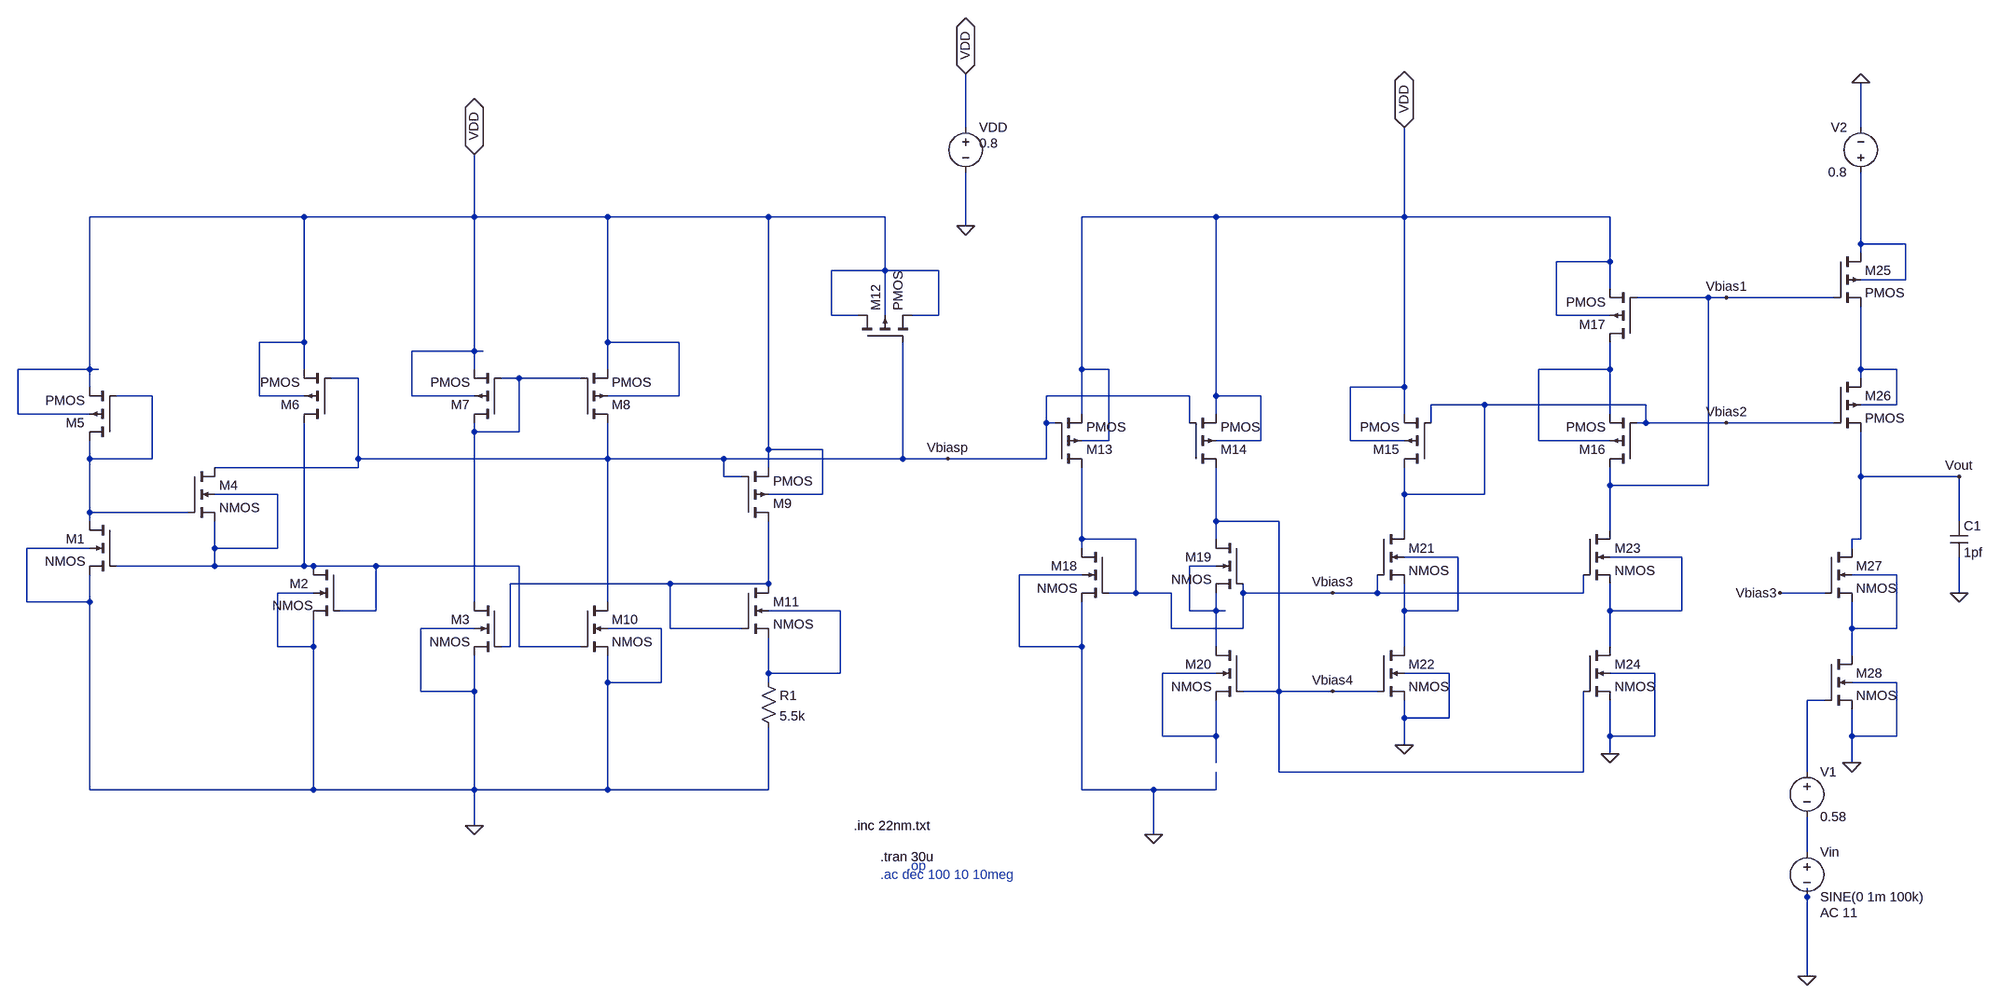
[diagram p0: schematic 22nm.asc]
22nm.asc, the LTspice schematic file:
Version 4
SHEET 1 3552 1044
WIRE 1664 -560 1664 -656
WIRE 3264 -560 3264 -640
WIRE 432 -400 48 -400
WIRE 736 -400 736 -512
WIRE 736 -400 432 -400
WIRE 1024 -400 736 -400
WIRE 1312 -400 1024 -400
WIRE 1520 -400 1312 -400
WIRE 2112 -400 1872 -400
WIRE 2448 -400 2448 -560
WIRE 2448 -400 2112 -400
WIRE 2816 -400 2448 -400
WIRE 1664 -384 1664 -480
WIRE 3264 -352 3264 -480
WIRE 3344 -352 3264 -352
WIRE 3264 -336 3264 -352
WIRE 2816 -320 2816 -400
WIRE 2816 -320 2720 -320
WIRE 1520 -304 1520 -400
WIRE 1520 -304 1424 -304
WIRE 1616 -304 1520 -304
WIRE 3344 -288 3344 -352
WIRE 3344 -288 3264 -288
WIRE 2816 -272 2816 -320
WIRE 2992 -256 2864 -256
WIRE 3024 -256 2992 -256
WIRE 3216 -256 3024 -256
WIRE 1424 -224 1424 -304
WIRE 1472 -224 1424 -224
WIRE 1520 -224 1520 -304
WIRE 1616 -224 1616 -304
WIRE 1616 -224 1568 -224
WIRE 2720 -224 2720 -320
WIRE 2816 -224 2720 -224
WIRE 432 -176 432 -400
WIRE 432 -176 352 -176
WIRE 1024 -176 1024 -400
WIRE 1152 -176 1024 -176
WIRE 736 -160 736 -400
WIRE 736 -160 624 -160
WIRE 752 -160 736 -160
WIRE 48 -128 48 -400
WIRE 48 -128 -80 -128
WIRE 64 -128 48 -128
WIRE 432 -128 432 -176
WIRE 736 -128 736 -160
WIRE 1024 -128 1024 -176
WIRE 1872 -128 1872 -400
WIRE 1920 -128 1872 -128
WIRE 2816 -128 2816 -176
WIRE 2816 -128 2688 -128
WIRE 3264 -128 3264 -240
WIRE 3328 -128 3264 -128
WIRE 528 -112 480 -112
WIRE 816 -112 784 -112
WIRE 976 -112 816 -112
WIRE 3264 -112 3264 -128
WIRE 48 -96 48 -128
WIRE 2448 -96 2448 -400
WIRE 2448 -96 2352 -96
WIRE 160 -80 96 -80
WIRE 352 -80 352 -176
WIRE 432 -80 352 -80
WIRE 624 -80 624 -160
WIRE 736 -80 624 -80
WIRE 1152 -80 1152 -176
WIRE 1152 -80 1024 -80
WIRE 2064 -80 1808 -80
WIRE 2112 -80 2112 -400
WIRE 2192 -80 2112 -80
WIRE 2592 -64 2496 -64
WIRE 2880 -64 2592 -64
WIRE 3328 -64 3328 -128
WIRE 3328 -64 3264 -64
WIRE -80 -48 -80 -128
WIRE 48 -48 -80 -48
WIRE 1872 -48 1872 -128
WIRE 2112 -48 2112 -80
WIRE 2448 -48 2448 -96
WIRE 2816 -48 2816 -128
WIRE 1808 -32 1808 -80
WIRE 1824 -32 1808 -32
WIRE 2064 -32 2064 -80
WIRE 2496 -32 2496 -64
WIRE 2880 -32 2880 -64
WIRE 2880 -32 2864 -32
WIRE 3024 -32 2880 -32
WIRE 3216 -32 3024 -32
WIRE 736 -16 736 -32
WIRE 816 -16 816 -112
WIRE 816 -16 736 -16
WIRE 1920 0 1920 -128
WIRE 1920 0 1872 0
WIRE 2192 0 2192 -80
WIRE 2192 0 2112 0
WIRE 2352 0 2352 -96
WIRE 2448 0 2352 0
WIRE 2688 0 2688 -128
WIRE 2816 0 2688 0
WIRE 1312 16 1312 -400
WIRE 1408 16 1312 16
WIRE 48 32 48 0
WIRE 160 32 160 -80
WIRE 160 32 48 32
WIRE 528 32 528 -112
WIRE 1024 32 1024 -32
WIRE 1024 32 528 32
WIRE 1232 32 1024 32
WIRE 1552 32 1552 -176
WIRE 1552 32 1232 32
WIRE 1632 32 1552 32
WIRE 1808 32 1808 -32
WIRE 1808 32 1632 32
WIRE 528 48 528 32
WIRE 528 48 272 48
WIRE 1312 48 1312 16
WIRE 1232 64 1232 32
WIRE 1264 64 1232 64
WIRE 3264 64 3264 -16
WIRE 3440 64 3264 64
WIRE 2816 80 2816 48
WIRE 2992 80 2992 -256
WIRE 2992 80 2816 80
WIRE 384 96 272 96
WIRE 1408 96 1408 16
WIRE 1408 96 1312 96
WIRE 2448 96 2448 48
WIRE 2592 96 2592 -64
WIRE 2592 96 2448 96
WIRE 48 128 48 32
WIRE 224 128 48 128
WIRE 48 144 48 128
WIRE 2112 144 2112 48
WIRE 2224 144 2112 144
WIRE 3440 144 3440 64
WIRE 2448 160 2448 96
WIRE 2816 160 2816 80
WIRE 1872 176 1872 48
WIRE 1968 176 1872 176
WIRE 2112 176 2112 144
WIRE 3264 176 3264 64
WIRE 3264 176 3248 176
WIRE 48 192 -64 192
WIRE 272 192 272 144
WIRE 384 192 384 96
WIRE 384 192 272 192
WIRE 1872 192 1872 176
WIRE 3248 192 3248 176
WIRE 2544 208 2448 208
WIRE 2944 208 2816 208
WIRE 272 224 272 192
WIRE 272 224 96 224
WIRE 432 224 432 -32
WIRE 432 224 272 224
WIRE 448 224 432 224
WIRE 560 224 448 224
WIRE 816 224 560 224
WIRE 2112 224 2064 224
WIRE 1872 240 1760 240
WIRE 3328 240 3248 240
WIRE 1136 256 800 256
WIRE 1312 256 1312 144
WIRE 1312 256 1136 256
WIRE 448 272 384 272
WIRE 1312 272 1312 256
WIRE 1968 272 1968 176
WIRE 1968 272 1920 272
WIRE 2032 272 1968 272
WIRE 2160 272 2160 256
WIRE 2320 272 2160 272
WIRE 2400 272 2400 240
WIRE 2400 272 2320 272
WIRE 2768 272 2768 240
WIRE 2768 272 2400 272
WIRE 3200 272 3120 272
WIRE 3440 272 3440 208
WIRE -64 288 -64 192
WIRE 48 288 48 240
WIRE 48 288 -64 288
WIRE 736 288 736 -16
WIRE 1024 288 1024 32
WIRE 560 304 560 224
WIRE 560 304 496 304
WIRE 1440 304 1312 304
WIRE 2064 304 2064 224
WIRE 2112 304 2112 272
WIRE 2112 304 2064 304
WIRE 2128 304 2112 304
WIRE 2448 304 2448 256
WIRE 2544 304 2544 208
WIRE 2544 304 2448 304
WIRE 2816 304 2816 256
WIRE 2944 304 2944 208
WIRE 2944 304 2816 304
WIRE 736 336 640 336
WIRE 1120 336 1024 336
WIRE 1136 336 1136 256
WIRE 1264 336 1136 336
WIRE 2032 336 2032 272
WIRE 2160 336 2160 272
WIRE 2160 336 2032 336
WIRE 3248 336 3248 288
WIRE 3328 336 3328 240
WIRE 3328 336 3248 336
WIRE 384 368 384 272
WIRE 448 368 448 320
WIRE 448 368 384 368
WIRE 800 368 800 256
WIRE 800 368 784 368
WIRE 816 368 816 224
WIRE 976 368 816 368
WIRE 1760 368 1760 240
WIRE 1872 368 1872 288
WIRE 1872 368 1760 368
WIRE 2112 368 2112 304
WIRE 2448 368 2448 304
WIRE 2816 368 2816 304
WIRE 3248 384 3248 336
WIRE 1312 416 1312 352
WIRE 1440 416 1440 304
WIRE 1440 416 1312 416
WIRE 2112 416 2016 416
WIRE 2528 416 2448 416
WIRE 2896 416 2816 416
WIRE 1024 432 1024 384
WIRE 1120 432 1120 336
WIRE 1120 432 1024 432
WIRE 1312 432 1312 416
WIRE 3328 432 3248 432
WIRE 640 448 640 336
WIRE 736 448 736 384
WIRE 736 448 640 448
WIRE 2224 448 2224 144
WIRE 2224 448 2160 448
WIRE 2320 448 2224 448
WIRE 2400 448 2320 448
WIRE 3200 464 3168 464
WIRE 2448 496 2448 464
WIRE 2528 496 2528 416
WIRE 2528 496 2448 496
WIRE 2016 528 2016 416
WIRE 2112 528 2112 464
WIRE 2112 528 2016 528
WIRE 2816 528 2816 464
WIRE 2896 528 2896 416
WIRE 2896 528 2816 528
WIRE 3248 528 3248 480
WIRE 3328 528 3328 432
WIRE 3328 528 3248 528
WIRE 2448 544 2448 496
WIRE 2816 560 2816 528
WIRE 2112 576 2112 528
WIRE 3248 576 3248 528
WIRE 2224 592 2224 448
WIRE 2768 592 2768 448
WIRE 2768 592 2224 592
WIRE 3168 592 3168 464
WIRE 48 624 48 288
WIRE 448 624 448 368
WIRE 448 624 48 624
WIRE 736 624 736 448
WIRE 736 624 448 624
WIRE 1024 624 1024 432
WIRE 1024 624 736 624
WIRE 1312 624 1312 512
WIRE 1312 624 1024 624
WIRE 1872 624 1872 368
WIRE 2000 624 1872 624
WIRE 2112 624 2112 592
WIRE 2112 624 2000 624
WIRE 736 688 736 624
WIRE 2000 704 2000 624
WIRE 3168 736 3168 672
WIRE 3168 816 3168 800
WIRE 3168 1024 3168 816
FLAG 2448 544 0
FLAG 2816 560 0
FLAG 3248 576 0
FLAG 3440 272 0
FLAG 1664 -384 0
FLAG 1664 -656 VDD
IOPIN 1664 -656 BiDir
FLAG 1632 32 Vbiasp
FLAG 3024 -256 Vbias1
FLAG 3024 -32 Vbias2
FLAG 2320 272 Vbias3
FLAG 2320 448 Vbias4
FLAG 3168 1024 0
FLAG 736 688 0
FLAG 2000 704 0
FLAG 3440 64 Vout
FLAG 3120 272 Vbias3
FLAG 736 -512 VDD
IOPIN 736 -512 BiDir
FLAG 2448 -560 VDD
IOPIN 2448 -560 BiDir
FLAG 3264 -640 0
SYMBOL nmos4 96 144 M0
SYMATTR InstName M1
SYMATTR Value2 l=44n w=220n
SYMBOL nmos4 496 224 M0
WINDOW 3 121 71 Right 2
SYMATTR InstName M2
SYMATTR Value2 l=44n w=220n
SYMBOL nmos4 784 288 M0
SYMATTR InstName M3
SYMATTR Value2 l=44n w=220n
SYMBOL nmos4 224 48 R0
SYMATTR InstName M4
SYMATTR Value2 l=44nm w=88nm
SYMBOL pmos4 96 0 R180
SYMATTR InstName M5
SYMATTR Value2 l=440nm w=220nm
SYMBOL pmos4 480 -32 R180
SYMATTR InstName M6
SYMATTR Value2 l=44n w=528n
SYMBOL pmos4 784 -32 R180
SYMATTR InstName M7
SYMATTR Value2 l=44n w=528n
SYMBOL pmos4 976 -32 M180
SYMATTR InstName M8
SYMATTR Value2 l=44n w=528n
SYMBOL pmos4 1264 144 M180
SYMATTR InstName M9
SYMATTR Value2 l=44n w=528n
SYMBOL nmos4 976 288 R0
SYMATTR InstName M10
SYMATTR Value2 l=44n w=220n
SYMBOL nmos4 1264 256 R0
SYMATTR InstName M11
SYMATTR Value2 l=44nm w=660n
SYMBOL res 1296 416 R0
SYMATTR InstName R1
SYMATTR Value 5.5k
SYMBOL pmos4 1824 48 M180
SYMATTR InstName M13
SYMATTR Value2 l=44n w=528n
SYMBOL pmos4 2064 48 M180
SYMATTR InstName M14
SYMATTR Value2 l=44n w=528n
SYMBOL pmos4 2496 48 R180
SYMATTR InstName M15
SYMATTR Value2 l=110nm w=440nm
SYMBOL pmos4 2864 48 R180
SYMATTR InstName M16
SYMATTR Value2 l=44n w=528n
SYMBOL pmos4 2864 -176 R180
SYMATTR InstName M17
SYMATTR Value2 l=44n w=528n
SYMBOL nmos4 1920 192 M0
SYMATTR InstName M18
SYMATTR Value2 l=44nm w=110nm
SYMBOL nmos4 2160 176 M0
SYMATTR InstName M19
SYMATTR Value2 l=44n w=220n
SYMBOL nmos4 2160 368 M0
SYMATTR InstName M20
SYMATTR Value2 l=44n w=220n
SYMBOL nmos4 2400 160 R0
SYMATTR InstName M21
SYMATTR Value2 l=44n w=220n
SYMBOL nmos4 2400 368 R0
SYMATTR InstName M22
SYMATTR Value2 l=44n w=220n
SYMBOL nmos4 2768 160 R0
SYMATTR InstName M23
SYMATTR Value2 l=44n w=220n
SYMBOL nmos4 2768 368 R0
SYMATTR InstName M24
SYMATTR Value2 l=44n w=220n
SYMBOL pmos4 3216 -336 R0
SYMATTR InstName M25
SYMATTR Value2 l=22n w=414.5n
SYMBOL pmos4 3216 -112 R0
SYMATTR InstName M26
SYMATTR Value2 l=22n w=414.5n
SYMBOL nmos4 3200 192 R0
SYMATTR InstName M27
SYMATTR Value2 l=22n w=207.35n
SYMBOL nmos4 3200 384 R0
SYMATTR InstName M28
SYMATTR Value2 l=22n w=207.35n
SYMBOL cap 3424 144 R0
SYMATTR InstName C1
SYMATTR Value 1pf
SYMBOL voltage 1664 -576 R0
WINDOW 3 24 44 Left 2
WINDOW 123 0 0 Left 0
WINDOW 39 0 0 Left 0
SYMATTR Value 0.8
SYMATTR InstName VDD
SYMBOL voltage 3168 720 R0
WINDOW 123 24 124 Left 2
WINDOW 39 0 0 Left 0
SYMATTR Value2 AC 11
SYMATTR InstName Vin
SYMATTR Value SINE(0 1m 100k)
SYMBOL pmos4 1472 -176 R270
SYMATTR InstName M12
SYMATTR Value2 l=1100n w=1100n
SYMBOL voltage 3168 576 R0
WINDOW 123 0 0 Left 0
WINDOW 39 0 0 Left 0
SYMATTR InstName V1
SYMATTR Value 0.58
SYMBOL voltage 3264 -464 R180
WINDOW 0 24 96 Left 2
WINDOW 3 24 16 Left 2
WINDOW 123 0 0 Left 0
WINDOW 39 0 0 Left 0
SYMATTR InstName V2
SYMATTR Value 0.8
TEXT 1464 688 Left 2 !.inc 22nm.txt
TEXT 1512 744 Left 2 !.tran 30u
TEXT 1560 760 Left 2 ;.op
TEXT 1512 776 Left 2 ;.ac dec 100 10 10meg

The netlist it stands for:
* 22nm.asc
M1 N005 N006 0 0 NMOS l=44n w=220n
M2 N006 N006 0 0 NMOS l=44n w=220n
M3 N004 N011 0 0 NMOS l=44n w=220n
M4 Vbiasp N005 N006 N006 NMOS l=44nm w=88nm
M5 N005 N005 VDD VDD PMOS l=440nm w=220nm
M6 N006 Vbiasp VDD VDD PMOS l=44n w=528n
M7 N004 N004 VDD VDD PMOS l=44n w=528n
M8 Vbiasp N004 VDD VDD PMOS l=44n w=528n
M9 N011 Vbiasp VDD VDD PMOS l=44n w=528n
M10 Vbiasp N006 0 0 NMOS l=44n w=220n
M11 N011 N011 N012 N012 NMOS l=44nm w=660n
R1 N012 0 5.5k
M13 Vbias3 Vbiasp VDD VDD PMOS l=44n w=528n
M14 Vbias4 Vbiasp VDD VDD PMOS l=44n w=528n
M15 Vbias2 Vbias2 VDD VDD PMOS l=110nm w=440nm
M16 Vbias1 Vbias2 N002 N002 PMOS l=44n w=528n
M17 N002 Vbias1 VDD VDD PMOS l=44n w=528n
M18 Vbias3 Vbias3 0 0 NMOS l=44nm w=110nm
M19 Vbias4 Vbias3 N009 N009 NMOS l=44n w=220n
M20 N009 Vbias4 N013 N013 NMOS l=44n w=220n
M21 Vbias2 Vbias3 N007 N007 NMOS l=44n w=220n
M22 N007 Vbias4 0 0 NMOS l=44n w=220n
M23 Vbias1 Vbias3 N008 N008 NMOS l=44n w=220n
M24 N008 Vbias4 0 0 NMOS l=44n w=220n
M25 N001 Vbias1 N003 N001 PMOS l=22n w=414.5n
M26 N003 Vbias2 Vout N003 PMOS l=22n w=414.5n
M27 Vout Vbias3 N010 N010 NMOS l=22n w=207.35n
M28 N010 N014 0 0 NMOS l=22n w=207.35n
C1 Vout 0 1pf
VDD VDD 0 0.8
Vin N015 0 SINE(0 1m 100k) AC 11
M12 VDD Vbiasp VDD VDD PMOS l=1100n w=1100n
V1 N014 N015 0.58
V2 N001 0 0.8
.model NMOS NMOS
.model PMOS PMOS
.lib standard.mos
.inc 22nm.txt
.tran 30u
* .op
* .ac dec 100 10 10meg
.backanno
.end